# EAGLE design YPORT+_Unterteil (EAGLE 7.5.0)
Assembly variants: <unbenannt>
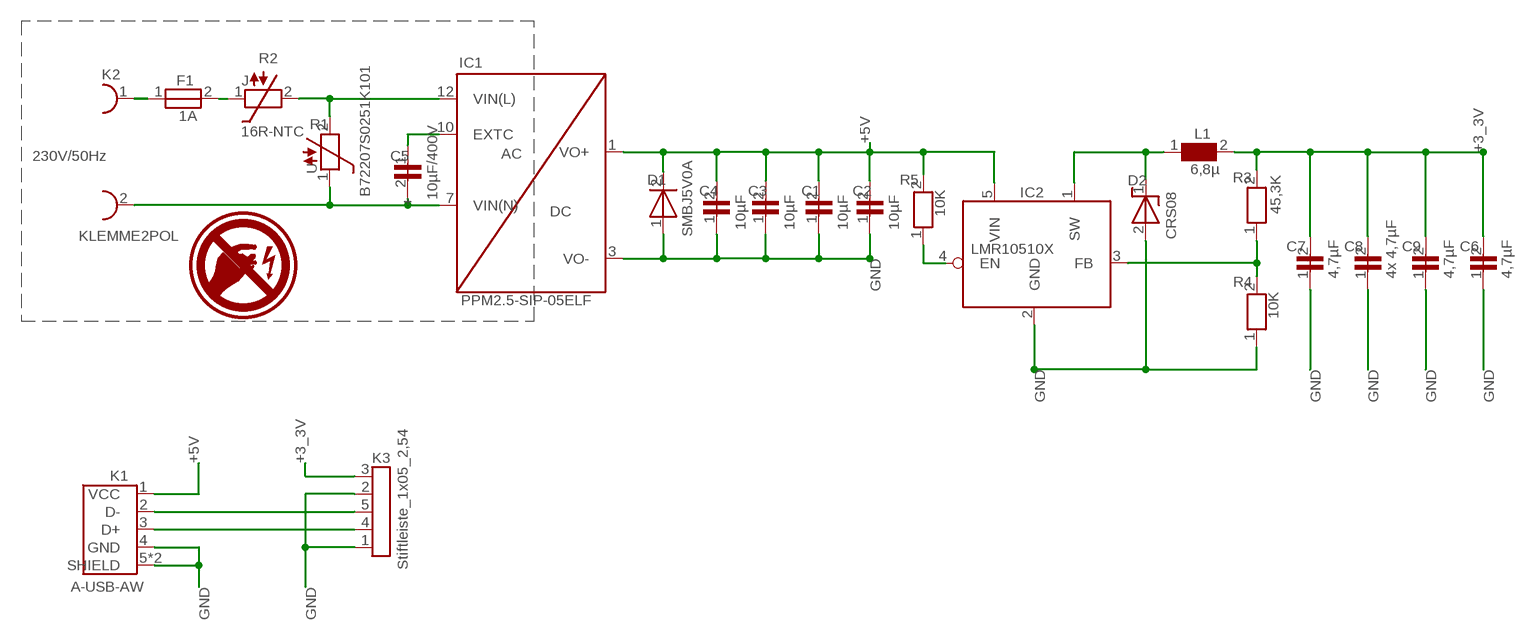
[diagram p0: schematic, sheet 1]

## Parts
C1  10µF  [0805]
C2  10µF  [0805]
C3  10µF  [0805]
C4  10µF  [0805]
C5  10µF/400V  [D10R5,08_ELKO]
C6  4,7µF  [0603_KLEIN]
C7  4,7µF  [0603_KLEIN]
C8  4x 4,7µF  4X_4,7µF  [0603_KLEIN]
C9  4,7µF  [0603_KLEIN]
D1  SMBJ5V0A  [DO214]
D2  CRS08  [SOD123]
F1  1A  [SMD-SICHERUNG]
IC1  PPM2.5-SIP-05ELF  [PPM1.65-S12-3R3ELF]
IC2  LMR10510X  [SOT23/5]
K1  A-USB-AW  [ASSMANN_A-USBS-A]
K2  KLEMME2POL  [AKL175_2]
K3  Stiftleiste_1x05_2,54  STIFTLEISTE_1X05_2,54  [STIFTLEISTE_1X05_G_2,54]
L1  6,8µ  [WÜRTH-744025002]
R1  B72207S0251K101  [6X10R5,08]
R2  16R-NTC  [6X10R5,08]
R3  45,3K  [0603_KLEIN]
R4  10K  [0603_KLEIN]
R5  10K  [0603_KLEIN]

## Nets
+3_3V: C6.2 C7.2 C8.2 C9.2 K3.3 L1.2 R3.2
+5V: C1.2 C2.2 C3.2 C4.2 D1.2 IC1.1(VO+) IC2.5(VIN) K1.1(VCC) R5.2
D+: K1.3(D+) K3.4
D-: K1.2(D-) K3.5
GND: C1.1 C2.1 C3.1 C4.1 C6.1 C7.1 C8.1 C9.1 D1.1 D2.2 IC1.3(VO-) IC2.2(GND) K1.4(GND) K1.5(SHIELD) K1.5_VIA_0(SHIELD) K3.1 K3.2 R4.1
SIG$3: F1.2 R2.1
SIG$4: IC1.12(VIN(L)) R1.2 R2.2
SIG$5: C5.2 IC1.7(VIN(N)) K2.2 R1.1
SIG$6: F1.1 K2.1
SIG$7: IC2.3(FB) R3.1 R4.2
SIG$8: C5.1(+) IC1.10(EXTC)
SIG$9: IC2.4(EN) R5.1
SW: D2.1 IC2.1(SW) L1.1

## Notes on the sheet
- 230V/50Hz

## Library data of the parts
C1-C4 = TARGET3001!_V31.8.0.48:10µF: SMD VS KONDENSATOR 0.1 UF 0805 50 V SMD-Vielschicht-Keramik-Kondensatoren Nennspannung 50 V - 1 pF - 1000 pF NPO; 1200 pF -1 µF X7R. Toleranz 1 pF ... 1000 pF: 5%; 1200 pF ... 1 µF: ±10%. Baugröße 0805 ; Wert 0,1 µ
C5 = TARGET3001!_V31.8.0.48:10µF/400V: Elektrolyt-Kondensatoren radial 105 øC, B41851-A3107-M..., Elko 400 V single endet , B43851A9106M[10UF/RM5]
C6 C7 C9 = TARGET3001!_V31.8.0.48:4,7µF: Keramik-Vielschicht-Kondensator 0,1µF, 50V
C8 = TARGET3001!_V31.8.0.48:4X_4,7µF: Keramik-Vielschicht-Kondensator 0,1µF, 50V
D1 = TARGET3001!_V31.8.0.48:SMBJ5V0A: Schutzdioden TRANSIL{~trademark}, SMD, Serie SM 6T6, Schutzdiode 600 W, SM6T 15A [DO214AA UNIDIR.]
D2 = TARGET3001!_V31.8.0.48:CRS08: Diode 40V, 1A
F1 = TARGET3001!_V31.8.0.48:1A: Rückstellbare Sicherungselement 0,3A, 60V
IC1 = TARGET3001!_V31.8.0.48:PPM2.5-SIP-05ELF
IC2 = TARGET3001!_V31.8.0.48:LMR10510X
K1 = TARGET3001!_V31.8.0.48:A-USB-AW: USB-Buchse Bauform-A abgewinkelt THT 04polig
K2 = TARGET3001!_V31.8.0.48:KLEMME2POL: Schraubklemme 2-polig RM5,08
K3 = TARGET3001!_V31.8.0.48:STIFTLEISTE_1X05_2,54: Stiftleiste
L1 = TARGET3001!_V31.8.0.48:6,8µ
R1 = TARGET3001!_V31.8.0.48:B72207S0251K101: Varistor
R2 = TARGET3001!_V31.8.0.48:16R-NTC: NTC-Widerstände scheibenförmig, Serie 235, Heissleiter [6 OHM], B57235-S609-M
R3 = TARGET3001!_V31.8.0.48:45,3K: SMD-Widerstand 1,5K-Ohm, 0,125W, 1%
R4 R5 = TARGET3001!_V31.8.0.48:10K: SMD-Widerstand 12K-Ohm, 0,125W, 1%

## Board
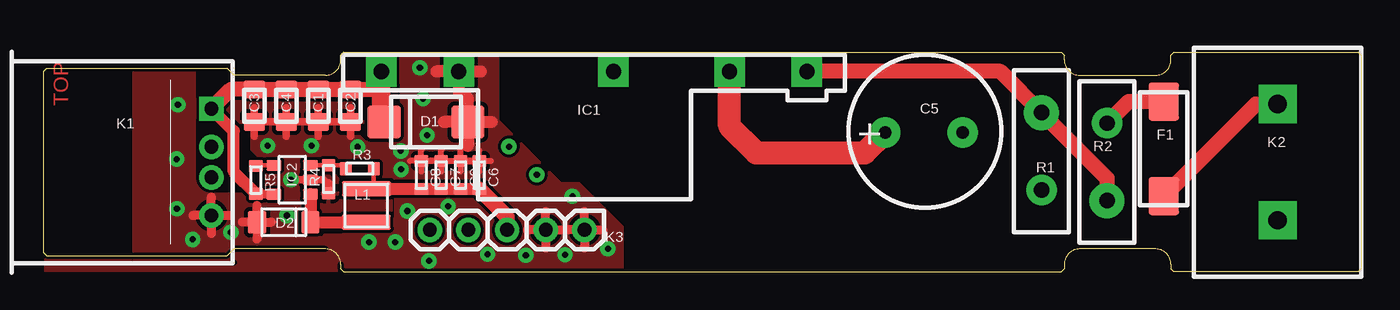
[diagram p1: board, top side]
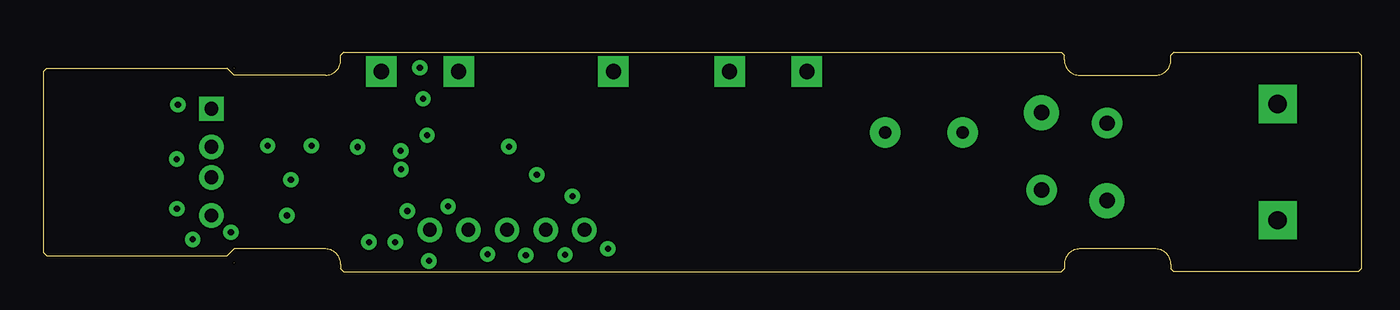
[diagram p2: board, inner layer 2]
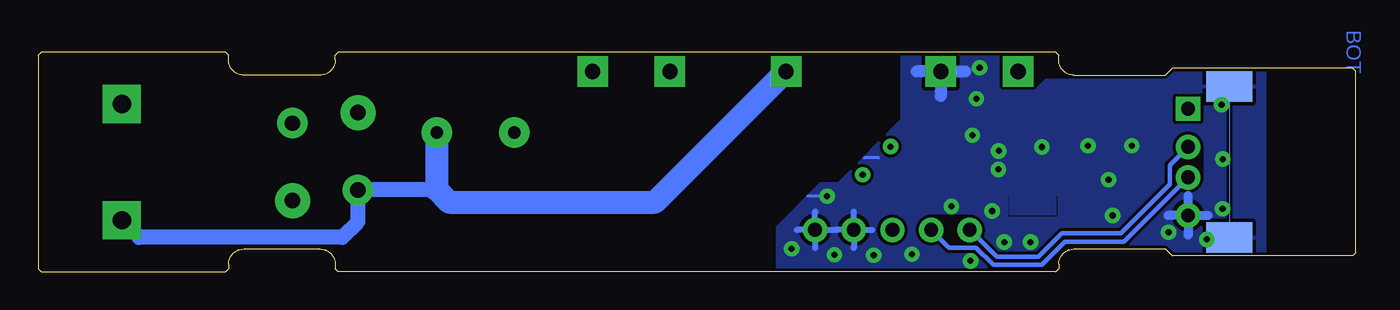
[diagram p3: board, bottom side, seen from below]

Size 86.5 x 14.4 mm. Coordinates in mm from the lower left corner, seen from the top.
Outline: 12.5,1.5 18.5,1.5 arc-90 19.5,0.5 19.5,0.2 19.7,0 66.8,0 67,0.2 67,0.5 arc-90 68,1.5 73,1.5 arc-90 74,0.5 74,0.2 74.2,0 86.3,0 86.5,0.2 86.5,14.2 86.3,14.4 74.2,14.4 74,14.2 74,13.9 arc-90 73,12.9 68,12.9 arc-90 67,13.9 67,14.2 66.8,14.4 19.7,14.4 19.5,14.2 19.5,13.9 arc-90 18.5,12.9 12.5,12.9
Outline: 12.5,12.9 12.5,12.9
Outline: 12.5,12.9 12.05,13.35 0.2,13.35 0,13.15 0,1.25 0.2,1.05 12.05,1.05 12.5,1.5
Outline: 12.5,1.5 12.5,1.5
Outline: 12.5,13.35 12.5,13.35
Outline: 12.5,0.6 12.5,0.6
Copper layers (1*16): Top 0.035mm / dielectric 1.5mm / Bottom 0.035mm
Design rules "TARGET3001!": minimum track width 0.2mm, minimum drill 0.4mm, track to track 0.2mm, track to pad 0.2mm, pad to pad 0.2mm, via to via 0.2mm, smd to smd 0.2mm, copper to edge 0mm, drill to drill 0.3mm, minimum pad ring 0.35mm, minimum via ring 0.3mm, stop-mask expansion 4mil, vias tented up to drill 0mil, thermal gap 10mil

### Footprints (pad centres in the part's own frame; a part is rotated, then mirrored left to right if it is on the bottom)
0805 = smd 1.165 x 1.38: 1 -1.067,0; 2 1.067,0
D10R5,08_ELKO = drill 0.8 pad 2 round: 1 -2.54,0; 2 2.54,0
0603_KLEIN = smd 0.8 x 0.9: 1 -0.917,0; 2 0.917,0
DO214 = smd 2.2 x 2.2: 1 -2.75,0; 2 2.75,0
SOD123 = smd 1.2 x 1.5: 1 1.75,0; 2 -1.75,0
SMD-SICHERUNG = smd 2.5 x 2: 1 0,0; 2 6.2,0
PPM1.65-S12-3R3ELF = drill 1 pad 2 square: 1 0,0; 3 5.08,0; 7 15.24,0; 10 22.86,0; 12 27.94,0
SOT23/5 = smd 0.7 x 1: 1 -0.95,-1.2; 2 -0.001,-1.2; 3 0.95,-1.2; 4 0.95,1.2; 5 -0.95,1.2
ASSMANN_A-USBS-A = drill 0.9 pad 1.6 square: 1 -3.5,5.86 | drill 0.9 pad 1.6 round: 2 -1,5.86; 3 1,5.86; 4 3.5,5.86 | smd 2 x 3 bottom: 5 -4.955,3.15; 5_VIA_0 4.953,3.15
AKL175_2 = drill 1.2 pad 2.5 square: 1 3.81,0; 2 -3.81,0
STIFTLEISTE_1X05_G_2,54 = drill 0.9 pad 1.6 round: 1 0,0; 2 2.54,0; 3 5.08,0; 4 7.62,0; 5 10.16,0
WÜRTH-744025002 = smd 1 x 3.2: 1 -1.1,0; 2 1.1,0
6X10R5,08 = drill 1 pad 2 round: 1 -2.54,0 | drill 1 pad 2.3 round: 2 2.54,0

### Placement (x,y rotation side)
C1  18.02,10.9 90 top
C2  20.15,10.9 90 top
C3  13.82,10.9 90 top
C4  15.93,10.9 90 top
C5  57.78,9.14 0 top
C6  28.59,6.36 270 top
C7  26.09,6.36 270 top
C8  24.79,6.35 270 top
C9  27.37,6.35 270 top
D1  25.1,9.83 180 top
D2  15.76,3.25 0 top
F1  73.52,4.97 90 top
IC1  22.16,13.15 0 top
IC2  16.32,6.04 90 top
K1  5.15,7.2 270 top
K2  81,7.2 90 top
K3  35.5,2.75 180 top
L1  21.18,4.35 90 top
R1  65.5,7.91 90 top
R2  69.8,7.21 270 top
R3  20.75,6.77 0 top
R4  18.71,6.07 90 top
R5  13.93,6.03 270 top

### Tracks (layer width: path | path; a pad name or v marks a point on that pad's centre or on a via)
2
  cutout Top: -26.9,-14.5 -26.91,-14.49 -26.92,-14.5 -26.92,-14.51 -26.92,-14.51 -26.91,-14.52 -26.9,-14.53 -26.89,-14.52 -26.89,-14.51 -26.89,-14.5
  cutout Top: 29.97,14.37 29.96,14.38 29.95,14.38 29.95,14.38 29.94,14.37 29.94,9.94 29.95,9.93 29.95,9.93 29.96,9.93 29.97,9.94
  cutout Top: 33.97,5.91 33.98,5.91 33.99,5.91 33.99,5.92 33.99,5.93 29.96,9.95 29.95,9.96 29.95,9.95 29.94,9.94 29.95,9.93
  cutout Top: 33.98,5.93 33.97,5.93 33.97,5.92 33.97,5.91 33.98,5.91 35.2,5.91 35.2,5.91 35.21,5.92 35.2,5.93 35.2,5.93
  cutout Top: 38.11,2.99 38.11,2.99 38.12,2.99 38.13,3 38.12,3.01 35.2,5.93 35.2,5.93 35.19,5.93 35.18,5.92 35.19,5.91
  cutout Top: 38.1,-0.01 38.11,-0.01 38.11,-0.02 38.12,-0.01 38.13,-0.01 38.13,3 38.12,3.01 38.11,3.01 38.11,3.01 38.1,3
  cutout Top: 38.1,0 38.1,-0.01 38.1,-0.02 38.11,-0.02 38.12,-0.02 38.12,-0.01 38.13,-0.01 38.12,0 38.11,0.01 38.11,0
  cutout Bottom: 29.97,14.4 29.96,14.41 29.95,14.41 29.95,14.41 29.94,14.4 29.94,9.97 29.95,9.96 29.95,9.96 29.96,9.96 29.97,9.97
  cutout Bottom: 34,5.91 34.01,5.91 34.02,5.91 34.02,5.92 34.02,5.93 29.96,9.98 29.95,9.98 29.95,9.98 29.94,9.97 29.95,9.96
  cutout Bottom: 35.18,5.91 35.19,5.91 35.19,5.92 35.19,5.93 35.18,5.93 34.01,5.93 34,5.93 33.99,5.92 34,5.91 34.01,5.91
  cutout Bottom: 38.11,2.97 38.12,2.97 38.12,2.97 38.13,2.98 38.12,2.99 35.19,5.93 35.18,5.93 35.17,5.93 35.17,5.92 35.17,5.91
  cutout Bottom: 38.1,0.01 38.11,0 38.12,-0.01 38.12,0 38.13,0.01 38.13,2.98 38.12,2.99 38.12,2.99 38.11,2.99 38.1,2.98
  cutout Bottom: 38.11,0.01 38.1,0 38.11,0 38.11,-0.01 38.12,0 38.12,0 38.13,0.01 38.12,0.01 38.12,0.02 38.11,0.01
  cutout Bottom: 27.94,3.71 27.95,3.72 27.96,3.73 27.95,3.73 27.94,3.74 25.4,3.74 25.39,3.73 25.38,3.73 25.39,3.72 25.4,3.71
  cutout Bottom: 10.01,6.18 10.01,6.18 10.02,6.17 10.03,6.18 10.03,6.18 10.03,8.2 10.03,8.21 10.02,8.21 10.01,8.21 10.01,8.2
  cutout Bottom: 20.38,12.7 20.38,12.71 20.39,12.71 20.38,12.72 20.38,12.73 18.33,12.73 18.32,12.72 18.32,12.71 18.32,12.71 18.33,12.7
  cutout Bottom: 21.07,12.01 21.08,12 21.08,12.01 21.09,12.01 21.08,12.02 20.38,12.72 20.38,12.73 20.37,12.72 20.36,12.71 20.37,12.71
  cutout Top: 14.48,5.65 14.49,5.64 14.5,5.63 14.51,5.64 14.51,5.65 14.51,6.45 14.51,6.45 14.5,6.46 14.49,6.45 14.48,6.45
  cutout Top: 13.57,11.11 13.57,11.12 13.56,11.12 13.55,11.12 13.55,11.11 13.55,10.58 13.55,10.57 13.56,10.57 13.57,10.57 13.57,10.58
  cutout Top: 13.66,11.19 13.66,11.2 13.66,11.2 13.65,11.21 13.64,11.2 13.55,11.12 13.55,11.11 13.55,11.1 13.56,11.1 13.57,11.1
  cutout Top: 20.26,11.18 20.26,11.19 20.27,11.2 20.26,11.2 20.26,11.21 13.65,11.21 13.64,11.2 13.64,11.2 13.64,11.19 13.65,11.18
  cutout Top: 20.4,11.03 20.41,11.03 20.42,11.03 20.42,11.04 20.42,11.05 20.26,11.2 20.26,11.21 20.25,11.2 20.24,11.2 20.25,11.19
  cutout Top: 20.4,10.53 20.4,10.52 20.41,10.51 20.42,10.52 20.42,10.53 20.42,11.04 20.42,11.05 20.41,11.06 20.4,11.05 20.4,11.04
  cutout Top: 20.41,10.51 20.42,10.51 20.42,10.51 20.43,10.52 20.42,10.53 20.42,10.54 20.41,10.54 20.4,10.54 20.4,10.53 20.4,10.52
  cutout Top: 13.54,7.95 13.55,7.94 13.56,7.94 13.56,7.94 13.57,7.95 13.57,9.09 13.56,9.09 13.56,9.1 13.55,9.09 13.54,9.09
  cutout Top: 14,7.49 14.01,7.48 14.02,7.49 14.02,7.5 14.02,7.5 13.56,7.96 13.56,7.96 13.55,7.96 13.54,7.95 13.55,7.94
  cutout Top: 10.04,13.67 10.04,13.68 10.03,13.69 10.02,13.68 10.02,13.67 10.02,11.43 10.02,11.43 10.03,11.42 10.04,11.43 10.04,11.43
  cutout Top: 10.02,6.12 10.02,6.11 10.03,6.11 10.04,6.11 10.04,6.12 10.04,10.03 10.04,10.04 10.03,10.04 10.02,10.04 10.02,10.03
  cutout Top: 10.04,6.1 10.04,6.1 10.05,6.1 10.06,6.11 10.05,6.12 10.04,6.13 10.03,6.13 10.02,6.13 10.02,6.12 10.02,6.11
  cutout Top: 11.04,5.25 11.03,5.25 11.02,5.24 11.03,5.23 11.04,5.23 12.99,5.23 13,5.23 13,5.24 13,5.25 12.99,5.25
  cutout Top: 13.16,5.05 13.17,5.05 13.18,5.05 13.18,5.06 13.18,5.07 13,5.25 12.99,5.25 12.98,5.25 12.98,5.24 12.98,5.23
  cutout Top: 18.53,6.45 18.54,6.46 18.54,6.47 18.54,6.48 18.53,6.48 18.5,6.48 18.49,6.48 18.48,6.47 18.49,6.46 18.5,6.45
  cutout Top: 18.8,7.5 18.79,7.5 18.78,7.49 18.79,7.48 18.8,7.48 18.91,7.48 18.91,7.48 18.92,7.49 18.91,7.5 18.91,7.5
  cutout Top: 24.52,6.01 24.53,6.01 24.53,6.02 24.53,6.03 24.52,6.03 22.98,6.03 22.97,6.03 22.96,6.02 22.97,6.01 22.98,6.01
  cutout Top: 22.87,6.15 22.86,6.15 22.85,6.15 22.84,6.14 22.85,6.13 22.97,6.01 22.97,6.01 22.98,6.01 22.99,6.02 22.98,6.03
  cutout Top: 25.55,7.85 25.56,7.86 25.56,7.87 25.56,7.88 25.55,7.88 25.25,7.88 25.25,7.88 25.24,7.87 25.25,7.86 25.25,7.85
  cutout Top: 25.55,7.85 25.55,7.85 25.56,7.85 25.57,7.86 25.56,7.87 25.56,7.88 25.55,7.88 25.54,7.88 25.54,7.87 25.54,7.86
  cutout Top: 26.87,7.85 26.88,7.86 26.89,7.86 26.88,7.87 26.87,7.88 26.57,7.88 26.56,7.87 26.55,7.86 26.56,7.86 26.57,7.85
  cutout Top: 28.08,7.85 28.09,7.85 28.1,7.86 28.09,7.87 28.08,7.87 27.86,7.87 27.85,7.87 27.85,7.86 27.85,7.85 27.86,7.85
  cutout Top: 28.08,7.85 28.09,7.84 28.1,7.85 28.1,7.86 28.1,7.86 28.09,7.87 28.08,7.87 28.07,7.87 28.07,7.86 28.07,7.85
  cutout Top: 25.58,6.67 25.59,6.67 25.59,6.68 25.59,6.69 25.58,6.7 25.28,6.7 25.27,6.69 25.27,6.68 25.27,6.67 25.28,6.67
  cutout Top: 25.58,6.67 25.59,6.67 25.59,6.67 25.6,6.68 25.59,6.69 25.59,6.69 25.58,6.7 25.57,6.69 25.57,6.68 25.57,6.67
  cutout Top: 26.87,6.67 26.88,6.67 26.88,6.68 26.88,6.69 26.87,6.7 26.6,6.7 26.59,6.69 26.59,6.68 26.59,6.67 26.6,6.67
  cutout Top: 28.08,6.67 28.09,6.67 28.09,6.68 28.09,6.69 28.08,6.69 27.85,6.69 27.84,6.69 27.84,6.68 27.84,6.67 27.85,6.67
  cutout Top: 28.1,6.68 28.1,6.69 28.1,6.7 28.09,6.7 28.08,6.7 28.07,6.69 28.07,6.68 28.07,6.67 28.08,6.67 28.09,6.67
  cutout Top: 20.71,9.05 20.72,9.05 20.72,9.06 20.72,9.07 20.71,9.07 20.7,9.07 20.69,9.07 20.69,9.06 20.69,9.05 20.7,9.05
  cutout Top: 21.13,8.62 21.14,8.62 21.15,8.62 21.15,8.63 21.15,8.64 20.72,9.07 20.71,9.07 20.7,9.07 20.7,9.06 20.7,9.05
  cutout Top: 23.32,11.02 23.33,11.01 23.34,11.01 23.35,11.01 23.35,11.02 23.35,12.32 23.35,12.33 23.34,12.33 23.33,12.33 23.32,12.32
  cutout Top: 21.23,7.4 21.23,7.4 21.24,7.41 21.23,7.42 21.23,7.42 20.25,7.42 20.24,7.42 20.24,7.41 20.24,7.4 20.25,7.4
  cutout Top: 21.22,7.4 21.23,7.4 21.24,7.4 21.24,7.41 21.24,7.42 21.23,7.42 21.23,7.42 21.22,7.42 21.21,7.41 21.22,7.4
  cutout Top: 22.96,4.85 22.96,4.86 22.95,4.86 22.94,4.86 22.94,4.85 22.94,3.79 22.94,3.78 22.95,3.77 22.96,3.78 22.96,3.79
  cutout Top: 18.98,6.23 18.98,6.24 18.97,6.24 18.96,6.24 18.96,6.23 18.96,5.74 18.96,5.73 18.97,5.72 18.98,5.73 18.98,5.74
  cutout Top: 18.79,6.42 18.79,6.42 18.78,6.42 18.77,6.41 18.78,6.4 18.96,6.22 18.97,6.22 18.98,6.22 18.98,6.23 18.98,6.24
  cutout Top: 18.45,2.57 18.44,2.57 18.44,2.56 18.44,2.55 18.45,2.54 19.59,2.54 19.59,2.55 19.6,2.56 19.59,2.57 19.59,2.57
  cutout Top: 18.23,2.36 18.23,2.35 18.23,2.34 18.24,2.34 18.25,2.34 18.46,2.55 18.46,2.56 18.46,2.57 18.45,2.57 18.44,2.57
  cutout Top: 5.8,0.73 5.81,0.72 5.82,0.72 5.82,0.72 5.83,0.73 5.83,13.8 5.82,13.81 5.82,13.81 5.81,13.81 5.8,13.8
  cutout Bottom: 5.82,0.68 5.82,0.67 5.83,0.67 5.84,0.67 5.84,0.68 5.84,13.7 5.84,13.7 5.83,13.71 5.82,13.7 5.82,13.7
  cutout Bottom: 19.61,4.96 19.61,4.97 19.6,4.97 19.59,4.97 19.59,4.96 19.59,3.65 19.59,3.64 19.6,3.64 19.61,3.64 19.61,3.65
  cutout Bottom: 22.77,4.95 22.78,4.95 22.78,4.96 22.78,4.97 22.77,4.97 19.6,4.97 19.59,4.97 19.59,4.96 19.59,4.95 19.6,4.95
  cutout Bottom: 22.76,3.65 22.76,3.64 22.77,3.64 22.78,3.64 22.78,3.65 22.78,4.96 22.78,4.97 22.77,4.97 22.76,4.97 22.76,4.96
  cutout Bottom: 19.6,3.66 19.59,3.66 19.59,3.65 19.59,3.64 19.6,3.64 22.77,3.64 22.78,3.64 22.78,3.65 22.78,3.66 22.77,3.66
  cutout Bottom: 0.2,13.15 0.14,13.29 0,13.35 -0.14,13.29 -0.2,13.15 -0.2,1.25 -0.14,1.11 0,1.05 0.14,1.11 0.2,1.25
  cutout layer 2: 0.2,13.15 0.14,13.29 0,13.35 -0.14,13.29 -0.2,13.15 -0.2,1.25 -0.14,1.11 0,1.05 0.14,1.11 0.2,1.25
  cutout layer 2: 0.2,13.15 0.14,13.29 0,13.35 -0.14,13.29 -0.2,13.15 -0.2,1.25 -0.14,1.11 0,1.05 0.14,1.11 0.2,1.25
  cutout Top: 0.2,13.15 0.14,13.29 0,13.35 -0.14,13.29 -0.2,13.15 -0.2,1.25 -0.14,1.11 0,1.05 0.14,1.11 0.2,1.25
  cutout Bottom: 86.3,0.2 86.36,0.06 86.5,0 86.64,0.06 86.7,0.2 86.7,14.2 86.64,14.34 86.5,14.4 86.36,14.34 86.3,14.2
  cutout layer 2: 86.3,0.2 86.36,0.06 86.5,0 86.64,0.06 86.7,0.2 86.7,14.2 86.64,14.34 86.5,14.4 86.36,14.34 86.3,14.2
  cutout layer 2: 86.3,0.2 86.36,0.06 86.5,0 86.64,0.06 86.7,0.2 86.7,14.2 86.64,14.34 86.5,14.4 86.36,14.34 86.3,14.2
  cutout Top: 86.3,0.2 86.36,0.06 86.5,0 86.64,0.06 86.7,0.2 86.7,14.2 86.64,14.34 86.5,14.4 86.36,14.34 86.3,14.2
  cutout Bottom: 12.05,13.15 12.19,13.21 12.25,13.35 12.19,13.49 12.05,13.55 0.2,13.55 0.06,13.49 0,13.35 0.06,13.21 0.2,13.15
  cutout layer 2: 12.05,13.15 12.19,13.21 12.25,13.35 12.19,13.49 12.05,13.55 0.2,13.55 0.06,13.49 0,13.35 0.06,13.21 0.2,13.15
  cutout layer 2: 12.05,13.15 12.19,13.21 12.25,13.35 12.19,13.49 12.05,13.55 0.2,13.55 0.06,13.49 0,13.35 0.06,13.21 0.2,13.15
  cutout Top: 12.05,13.15 12.19,13.21 12.25,13.35 12.19,13.49 12.05,13.55 0.2,13.55 0.06,13.49 0,13.35 0.06,13.21 0.2,13.15
  cutout Bottom: 12.5,1.7 12.36,1.64 12.3,1.5 12.36,1.36 12.5,1.3 18.5,1.3 18.64,1.36 18.7,1.5 18.64,1.64 18.5,1.7
  cutout layer 2: 12.5,1.7 12.36,1.64 12.3,1.5 12.36,1.36 12.5,1.3 18.5,1.3 18.64,1.36 18.7,1.5 18.64,1.64 18.5,1.7
  cutout layer 2: 12.5,1.7 12.36,1.64 12.3,1.5 12.36,1.36 12.5,1.3 18.5,1.3 18.64,1.36 18.7,1.5 18.64,1.64 18.5,1.7
  cutout Top: 12.5,1.7 12.36,1.64 12.3,1.5 12.36,1.36 12.5,1.3 18.5,1.3 18.64,1.36 18.7,1.5 18.64,1.64 18.5,1.7
  cutout Bottom: 19.3,0.2 19.36,0.06 19.5,0 19.64,0.06 19.7,0.2 19.7,0.5 19.64,0.64 19.5,0.7 19.36,0.64 19.3,0.5
  cutout layer 2: 19.3,0.2 19.36,0.06 19.5,0 19.64,0.06 19.7,0.2 19.7,0.5 19.64,0.64 19.5,0.7 19.36,0.64 19.3,0.5
  cutout layer 2: 19.3,0.2 19.36,0.06 19.5,0 19.64,0.06 19.7,0.2 19.7,0.5 19.64,0.64 19.5,0.7 19.36,0.64 19.3,0.5
  cutout Top: 19.3,0.2 19.36,0.06 19.5,0 19.64,0.06 19.7,0.2 19.7,0.5 19.64,0.64 19.5,0.7 19.36,0.64 19.3,0.5
  cutout Bottom: 12.05,0.85 12.19,0.91 12.25,1.05 12.19,1.19 12.05,1.25 0.2,1.25 0.06,1.19 0,1.05 0.06,0.91 0.2,0.85
  cutout layer 2: 12.05,0.85 12.19,0.91 12.25,1.05 12.19,1.19 12.05,1.25 0.2,1.25 0.06,1.19 0,1.05 0.06,0.91 0.2,0.85
  cutout layer 2: 12.05,0.85 12.19,0.91 12.25,1.05 12.19,1.19 12.05,1.25 0.2,1.25 0.06,1.19 0,1.05 0.06,0.91 0.2,0.85
  cutout Top: 12.05,0.85 12.19,0.91 12.25,1.05 12.19,1.19 12.05,1.25 0.2,1.25 0.06,1.19 0,1.05 0.06,0.91 0.2,0.85
  cutout Bottom: 74.2,0.2 74.06,0.14 74,0 74.06,-0.14 74.2,-0.2 86.3,-0.2 86.44,-0.14 86.5,0 86.44,0.14 86.3,0.2
  cutout layer 2: 74.2,0.2 74.06,0.14 74,0 74.06,-0.14 74.2,-0.2 86.3,-0.2 86.44,-0.14 86.5,0 86.44,0.14 86.3,0.2
  cutout layer 2: 74.2,0.2 74.06,0.14 74,0 74.06,-0.14 74.2,-0.2 86.3,-0.2 86.44,-0.14 86.5,0 86.44,0.14 86.3,0.2
  cutout Top: 74.2,0.2 74.06,0.14 74,0 74.06,-0.14 74.2,-0.2 86.3,-0.2 86.44,-0.14 86.5,0 86.44,0.14 86.3,0.2
  cutout Bottom: 12.7,13.35 12.67,13.46 12.58,13.53 12.47,13.55 12.37,13.5 12.31,13.41 12.31,13.29 12.37,13.2 12.47,13.15 12.58,13.17 12.67,13.24
  cutout layer 2: 12.7,13.35 12.67,13.46 12.58,13.53 12.47,13.55 12.37,13.5 12.31,13.41 12.31,13.29 12.37,13.2 12.47,13.15 12.58,13.17 12.67,13.24
  cutout layer 2: 12.7,13.35 12.67,13.46 12.58,13.53 12.47,13.55 12.37,13.5 12.31,13.41 12.31,13.29 12.37,13.2 12.47,13.15 12.58,13.17 12.67,13.24
  cutout Top: 12.7,13.35 12.67,13.46 12.58,13.53 12.47,13.55 12.37,13.5 12.31,13.41 12.31,13.29 12.37,13.2 12.47,13.15 12.58,13.17 12.67,13.24
  cutout Bottom: 12.5,13.1 12.36,13.04 12.3,12.9 12.36,12.76 12.5,12.7 18.5,12.7 18.64,12.76 18.7,12.9 18.64,13.04 18.5,13.1
  cutout layer 2: 12.5,13.1 12.36,13.04 12.3,12.9 12.36,12.76 12.5,12.7 18.5,12.7 18.64,12.76 18.7,12.9 18.64,13.04 18.5,13.1
  cutout layer 2: 12.5,13.1 12.36,13.04 12.3,12.9 12.36,12.76 12.5,12.7 18.5,12.7 18.64,12.76 18.7,12.9 18.64,13.04 18.5,13.1
  cutout Top: 12.5,13.1 12.36,13.04 12.3,12.9 12.36,12.76 12.5,12.7 18.5,12.7 18.64,12.76 18.7,12.9 18.64,13.04 18.5,13.1
  cutout Bottom: 19.7,14.2 19.64,14.34 19.5,14.4 19.36,14.34 19.3,14.2 19.3,13.9 19.36,13.76 19.5,13.7 19.64,13.76 19.7,13.9
  cutout layer 2: 19.7,14.2 19.64,14.34 19.5,14.4 19.36,14.34 19.3,14.2 19.3,13.9 19.36,13.76 19.5,13.7 19.64,13.76 19.7,13.9
  cutout layer 2: 19.7,14.2 19.64,14.34 19.5,14.4 19.36,14.34 19.3,14.2 19.3,13.9 19.36,13.76 19.5,13.7 19.64,13.76 19.7,13.9
  cutout Top: 19.7,14.2 19.64,14.34 19.5,14.4 19.36,14.34 19.3,14.2 19.3,13.9 19.36,13.76 19.5,13.7 19.64,13.76 19.7,13.9
  cutout Bottom: 66.8,14.2 66.94,14.26 67,14.4 66.94,14.54 66.8,14.6 19.7,14.6 19.56,14.54 19.5,14.4 19.56,14.26 19.7,14.2
  cutout layer 2: 66.8,14.2 66.94,14.26 67,14.4 66.94,14.54 66.8,14.6 19.7,14.6 19.56,14.54 19.5,14.4 19.56,14.26 19.7,14.2
  cutout layer 2: 66.8,14.2 66.94,14.26 67,14.4 66.94,14.54 66.8,14.6 19.7,14.6 19.56,14.54 19.5,14.4 19.56,14.26 19.7,14.2
  cutout Top: 66.8,14.2 66.94,14.26 67,14.4 66.94,14.54 66.8,14.6 19.7,14.6 19.56,14.54 19.5,14.4 19.56,14.26 19.7,14.2
  cutout Bottom: 73.8,0.2 73.86,0.06 74,0 74.14,0.06 74.2,0.2 74.2,0.5 74.14,0.64 74,0.7 73.86,0.64 73.8,0.5
  cutout layer 2: 73.8,0.2 73.86,0.06 74,0 74.14,0.06 74.2,0.2 74.2,0.5 74.14,0.64 74,0.7 73.86,0.64 73.8,0.5
  cutout layer 2: 73.8,0.2 73.86,0.06 74,0 74.14,0.06 74.2,0.2 74.2,0.5 74.14,0.64 74,0.7 73.86,0.64 73.8,0.5
  cutout Top: 73.8,0.2 73.86,0.06 74,0 74.14,0.06 74.2,0.2 74.2,0.5 74.14,0.64 74,0.7 73.86,0.64 73.8,0.5
  cutout Bottom: 68,1.7 67.86,1.64 67.8,1.5 67.86,1.36 68,1.3 73,1.3 73.14,1.36 73.2,1.5 73.14,1.64 73,1.7
  cutout layer 2: 68,1.7 67.86,1.64 67.8,1.5 67.86,1.36 68,1.3 73,1.3 73.14,1.36 73.2,1.5 73.14,1.64 73,1.7
  cutout layer 2: 68,1.7 67.86,1.64 67.8,1.5 67.86,1.36 68,1.3 73,1.3 73.14,1.36 73.2,1.5 73.14,1.64 73,1.7
  cutout Top: 68,1.7 67.86,1.64 67.8,1.5 67.86,1.36 68,1.3 73,1.3 73.14,1.36 73.2,1.5 73.14,1.64 73,1.7
  cutout Bottom: 66.8,0.2 66.86,0.06 67,0 67.14,0.06 67.2,0.2 67.2,0.5 67.14,0.64 67,0.7 66.86,0.64 66.8,0.5
  cutout layer 2: 66.8,0.2 66.86,0.06 67,0 67.14,0.06 67.2,0.2 67.2,0.5 67.14,0.64 67,0.7 66.86,0.64 66.8,0.5
  cutout layer 2: 66.8,0.2 66.86,0.06 67,0 67.14,0.06 67.2,0.2 67.2,0.5 67.14,0.64 67,0.7 66.86,0.64 66.8,0.5
  cutout Top: 66.8,0.2 66.86,0.06 67,0 67.14,0.06 67.2,0.2 67.2,0.5 67.14,0.64 67,0.7 66.86,0.64 66.8,0.5
  cutout Bottom: 66.8,-0.2 66.94,-0.14 67,0 66.94,0.14 66.8,0.2 19.7,0.2 19.56,0.14 19.5,0 19.56,-0.14 19.7,-0.2
  cutout layer 2: 66.8,-0.2 66.94,-0.14 67,0 66.94,0.14 66.8,0.2 19.7,0.2 19.56,0.14 19.5,0 19.56,-0.14 19.7,-0.2
  cutout layer 2: 66.8,-0.2 66.94,-0.14 67,0 66.94,0.14 66.8,0.2 19.7,0.2 19.56,0.14 19.5,0 19.56,-0.14 19.7,-0.2
  cutout Top: 66.8,-0.2 66.94,-0.14 67,0 66.94,0.14 66.8,0.2 19.7,0.2 19.56,0.14 19.5,0 19.56,-0.14 19.7,-0.2
  cutout Bottom: 74.2,14.2 74.14,14.34 74,14.4 73.86,14.34 73.8,14.2 73.8,13.9 73.86,13.76 74,13.7 74.14,13.76 74.2,13.9
  cutout layer 2: 74.2,14.2 74.14,14.34 74,14.4 73.86,14.34 73.8,14.2 73.8,13.9 73.86,13.76 74,13.7 74.14,13.76 74.2,13.9
  cutout layer 2: 74.2,14.2 74.14,14.34 74,14.4 73.86,14.34 73.8,14.2 73.8,13.9 73.86,13.76 74,13.7 74.14,13.76 74.2,13.9
  cutout Top: 74.2,14.2 74.14,14.34 74,14.4 73.86,14.34 73.8,14.2 73.8,13.9 73.86,13.76 74,13.7 74.14,13.76 74.2,13.9
  cutout Bottom: 73,12.7 73.14,12.76 73.2,12.9 73.14,13.04 73,13.1 68,13.1 67.86,13.04 67.8,12.9 67.86,12.76 68,12.7
  cutout layer 2: 73,12.7 73.14,12.76 73.2,12.9 73.14,13.04 73,13.1 68,13.1 67.86,13.04 67.8,12.9 67.86,12.76 68,12.7
  cutout layer 2: 73,12.7 73.14,12.76 73.2,12.9 73.14,13.04 73,13.1 68,13.1 67.86,13.04 67.8,12.9 67.86,12.76 68,12.7
  cutout Top: 73,12.7 73.14,12.76 73.2,12.9 73.14,13.04 73,13.1 68,13.1 67.86,13.04 67.8,12.9 67.86,12.76 68,12.7
  cutout Bottom: 67.2,14.2 67.14,14.34 67,14.4 66.86,14.34 66.8,14.2 66.8,13.9 66.86,13.76 67,13.7 67.14,13.76 67.2,13.9
  cutout layer 2: 67.2,14.2 67.14,14.34 67,14.4 66.86,14.34 66.8,14.2 66.8,13.9 66.86,13.76 67,13.7 67.14,13.76 67.2,13.9
  cutout layer 2: 67.2,14.2 67.14,14.34 67,14.4 66.86,14.34 66.8,14.2 66.8,13.9 66.86,13.76 67,13.7 67.14,13.76 67.2,13.9
  cutout Top: 67.2,14.2 67.14,14.34 67,14.4 66.86,14.34 66.8,14.2 66.8,13.9 66.86,13.76 67,13.7 67.14,13.76 67.2,13.9
  cutout Bottom: 86.3,14.2 86.44,14.26 86.5,14.4 86.44,14.54 86.3,14.6 74.2,14.6 74.06,14.54 74,14.4 74.06,14.26 74.2,14.2
  cutout layer 2: 86.3,14.2 86.44,14.26 86.5,14.4 86.44,14.54 86.3,14.6 74.2,14.6 74.06,14.54 74,14.4 74.06,14.26 74.2,14.2
  cutout layer 2: 86.3,14.2 86.44,14.26 86.5,14.4 86.44,14.54 86.3,14.6 74.2,14.6 74.06,14.54 74,14.4 74.06,14.26 74.2,14.2
  cutout Top: 86.3,14.2 86.44,14.26 86.5,14.4 86.44,14.54 86.3,14.6 74.2,14.6 74.06,14.54 74,14.4 74.06,14.26 74.2,14.2
  cutout Bottom: 19.64,0.34 19.5,0.4 19.36,0.34 19.3,0.2 19.36,0.06 19.56,-0.14 19.7,-0.2 19.84,-0.14 19.9,0 19.84,0.14
  cutout layer 2: 19.64,0.34 19.5,0.4 19.36,0.34 19.3,0.2 19.36,0.06 19.56,-0.14 19.7,-0.2 19.84,-0.14 19.9,0 19.84,0.14
  cutout layer 2: 19.64,0.34 19.5,0.4 19.36,0.34 19.3,0.2 19.36,0.06 19.56,-0.14 19.7,-0.2 19.84,-0.14 19.9,0 19.84,0.14
  cutout Top: 19.64,0.34 19.5,0.4 19.36,0.34 19.3,0.2 19.36,0.06 19.56,-0.14 19.7,-0.2 19.84,-0.14 19.9,0 19.84,0.14
  cutout Bottom: 19.36,14.34 19.3,14.2 19.36,14.06 19.5,14 19.64,14.06 19.84,14.26 19.9,14.4 19.84,14.54 19.7,14.6 19.56,14.54
  cutout layer 2: 19.36,14.34 19.3,14.2 19.36,14.06 19.5,14 19.64,14.06 19.84,14.26 19.9,14.4 19.84,14.54 19.7,14.6 19.56,14.54
  cutout layer 2: 19.36,14.34 19.3,14.2 19.36,14.06 19.5,14 19.64,14.06 19.84,14.26 19.9,14.4 19.84,14.54 19.7,14.6 19.56,14.54
  cutout Top: 19.36,14.34 19.3,14.2 19.36,14.06 19.5,14 19.64,14.06 19.84,14.26 19.9,14.4 19.84,14.54 19.7,14.6 19.56,14.54
  cutout Bottom: 66.86,14.06 67,14 67.14,14.06 67.2,14.2 67.14,14.34 66.94,14.54 66.8,14.6 66.66,14.54 66.6,14.4 66.66,14.26
  cutout layer 2: 66.86,14.06 67,14 67.14,14.06 67.2,14.2 67.14,14.34 66.94,14.54 66.8,14.6 66.66,14.54 66.6,14.4 66.66,14.26
  cutout layer 2: 66.86,14.06 67,14 67.14,14.06 67.2,14.2 67.14,14.34 66.94,14.54 66.8,14.6 66.66,14.54 66.6,14.4 66.66,14.26
  cutout Top: 66.86,14.06 67,14 67.14,14.06 67.2,14.2 67.14,14.34 66.94,14.54 66.8,14.6 66.66,14.54 66.6,14.4 66.66,14.26
  cutout Bottom: 73.86,14.34 73.8,14.2 73.86,14.06 74,14 74.14,14.06 74.34,14.26 74.4,14.4 74.34,14.54 74.2,14.6 74.06,14.54
  cutout layer 2: 73.86,14.34 73.8,14.2 73.86,14.06 74,14 74.14,14.06 74.34,14.26 74.4,14.4 74.34,14.54 74.2,14.6 74.06,14.54
  cutout layer 2: 73.86,14.34 73.8,14.2 73.86,14.06 74,14 74.14,14.06 74.34,14.26 74.4,14.4 74.34,14.54 74.2,14.6 74.06,14.54
  cutout Top: 73.86,14.34 73.8,14.2 73.86,14.06 74,14 74.14,14.06 74.34,14.26 74.4,14.4 74.34,14.54 74.2,14.6 74.06,14.54
  cutout Bottom: 86.44,14.54 86.3,14.6 86.16,14.54 86.1,14.4 86.16,14.26 86.36,14.06 86.5,14 86.64,14.06 86.7,14.2 86.64,14.34
  cutout layer 2: 86.44,14.54 86.3,14.6 86.16,14.54 86.1,14.4 86.16,14.26 86.36,14.06 86.5,14 86.64,14.06 86.7,14.2 86.64,14.34
  cutout layer 2: 86.44,14.54 86.3,14.6 86.16,14.54 86.1,14.4 86.16,14.26 86.36,14.06 86.5,14 86.64,14.06 86.7,14.2 86.64,14.34
  cutout Top: 86.44,14.54 86.3,14.6 86.16,14.54 86.1,14.4 86.16,14.26 86.36,14.06 86.5,14 86.64,14.06 86.7,14.2 86.64,14.34
  cutout Bottom: 86.16,0.14 86.1,0 86.16,-0.14 86.3,-0.2 86.44,-0.14 86.64,0.06 86.7,0.2 86.64,0.34 86.5,0.4 86.36,0.34
  cutout layer 2: 86.16,0.14 86.1,0 86.16,-0.14 86.3,-0.2 86.44,-0.14 86.64,0.06 86.7,0.2 86.64,0.34 86.5,0.4 86.36,0.34
  cutout layer 2: 86.16,0.14 86.1,0 86.16,-0.14 86.3,-0.2 86.44,-0.14 86.64,0.06 86.7,0.2 86.64,0.34 86.5,0.4 86.36,0.34
  cutout Top: 86.16,0.14 86.1,0 86.16,-0.14 86.3,-0.2 86.44,-0.14 86.64,0.06 86.7,0.2 86.64,0.34 86.5,0.4 86.36,0.34
  cutout Bottom: 74.14,0.34 74,0.4 73.86,0.34 73.8,0.2 73.86,0.06 74.06,-0.14 74.2,-0.2 74.34,-0.14 74.4,0 74.34,0.14
  cutout layer 2: 74.14,0.34 74,0.4 73.86,0.34 73.8,0.2 73.86,0.06 74.06,-0.14 74.2,-0.2 74.34,-0.14 74.4,0 74.34,0.14
  cutout layer 2: 74.14,0.34 74,0.4 73.86,0.34 73.8,0.2 73.86,0.06 74.06,-0.14 74.2,-0.2 74.34,-0.14 74.4,0 74.34,0.14
  cutout Top: 74.14,0.34 74,0.4 73.86,0.34 73.8,0.2 73.86,0.06 74.06,-0.14 74.2,-0.2 74.34,-0.14 74.4,0 74.34,0.14
  cutout Bottom: 67.14,0.06 67.2,0.2 67.14,0.34 67,0.4 66.86,0.34 66.66,0.14 66.6,0 66.66,-0.14 66.8,-0.2 66.94,-0.14
  cutout layer 2: 67.14,0.06 67.2,0.2 67.14,0.34 67,0.4 66.86,0.34 66.66,0.14 66.6,0 66.66,-0.14 66.8,-0.2 66.94,-0.14
  cutout layer 2: 67.14,0.06 67.2,0.2 67.14,0.34 67,0.4 66.86,0.34 66.66,0.14 66.6,0 66.66,-0.14 66.8,-0.2 66.94,-0.14
  cutout Top: 67.14,0.06 67.2,0.2 67.14,0.34 67,0.4 66.86,0.34 66.66,0.14 66.6,0 66.66,-0.14 66.8,-0.2 66.94,-0.14
  cutout Bottom: 12.7,0.6 12.67,0.71 12.58,0.78 12.47,0.8 12.37,0.75 12.31,0.66 12.31,0.54 12.37,0.45 12.47,0.4 12.58,0.42 12.67,0.49
  cutout layer 2: 12.7,0.6 12.67,0.71 12.58,0.78 12.47,0.8 12.37,0.75 12.31,0.66 12.31,0.54 12.37,0.45 12.47,0.4 12.58,0.42 12.67,0.49
  cutout layer 2: 12.7,0.6 12.67,0.71 12.58,0.78 12.47,0.8 12.37,0.75 12.31,0.66 12.31,0.54 12.37,0.45 12.47,0.4 12.58,0.42 12.67,0.49
  cutout Top: 12.7,0.6 12.67,0.71 12.58,0.78 12.47,0.8 12.37,0.75 12.31,0.66 12.31,0.54 12.37,0.45 12.47,0.4 12.58,0.42 12.67,0.49
  cutout Bottom: 0.34,13.21 0.4,13.35 0.34,13.49 0.2,13.55 0.06,13.49 -0.14,13.29 -0.2,13.15 -0.14,13.01 0,12.95 0.14,13.01
  cutout layer 2: 0.34,13.21 0.4,13.35 0.34,13.49 0.2,13.55 0.06,13.49 -0.14,13.29 -0.2,13.15 -0.14,13.01 0,12.95 0.14,13.01
  cutout layer 2: 0.34,13.21 0.4,13.35 0.34,13.49 0.2,13.55 0.06,13.49 -0.14,13.29 -0.2,13.15 -0.14,13.01 0,12.95 0.14,13.01
  cutout Top: 0.34,13.21 0.4,13.35 0.34,13.49 0.2,13.55 0.06,13.49 -0.14,13.29 -0.2,13.15 -0.14,13.01 0,12.95 0.14,13.01
  cutout Bottom: 0.06,0.91 0.2,0.85 0.34,0.91 0.4,1.05 0.34,1.19 0.14,1.39 0,1.45 -0.14,1.39 -0.2,1.25 -0.14,1.11
  cutout layer 2: 0.06,0.91 0.2,0.85 0.34,0.91 0.4,1.05 0.34,1.19 0.14,1.39 0,1.45 -0.14,1.39 -0.2,1.25 -0.14,1.11
  cutout layer 2: 0.06,0.91 0.2,0.85 0.34,0.91 0.4,1.05 0.34,1.19 0.14,1.39 0,1.45 -0.14,1.39 -0.2,1.25 -0.14,1.11
  cutout Top: 0.06,0.91 0.2,0.85 0.34,0.91 0.4,1.05 0.34,1.19 0.14,1.39 0,1.45 -0.14,1.39 -0.2,1.25 -0.14,1.11
  cutout Bottom: 12.3,12.9 12.36,12.76 12.5,12.7 12.64,12.76 12.7,12.9 12.7,12.9 12.64,13.04 12.5,13.1 12.36,13.04 12.3,12.9
  cutout layer 2: 12.3,12.9 12.36,12.76 12.5,12.7 12.64,12.76 12.7,12.9 12.7,12.9 12.64,13.04 12.5,13.1 12.36,13.04 12.3,12.9
  cutout layer 2: 12.3,12.9 12.36,12.76 12.5,12.7 12.64,12.76 12.7,12.9 12.7,12.9 12.64,13.04 12.5,13.1 12.36,13.04 12.3,12.9
  cutout Top: 12.3,12.9 12.36,12.76 12.5,12.7 12.64,12.76 12.7,12.9 12.7,12.9 12.64,13.04 12.5,13.1 12.36,13.04 12.3,12.9
  cutout Bottom: 12.19,13.49 12.05,13.55 11.91,13.49 11.85,13.35 11.91,13.21 12.36,12.76 12.5,12.7 12.64,12.76 12.7,12.9 12.64,13.04
  cutout layer 2: 12.19,13.49 12.05,13.55 11.91,13.49 11.85,13.35 11.91,13.21 12.36,12.76 12.5,12.7 12.64,12.76 12.7,12.9 12.64,13.04
  cutout layer 2: 12.19,13.49 12.05,13.55 11.91,13.49 11.85,13.35 11.91,13.21 12.36,12.76 12.5,12.7 12.64,12.76 12.7,12.9 12.64,13.04
  cutout Top: 12.19,13.49 12.05,13.55 11.91,13.49 11.85,13.35 11.91,13.21 12.36,12.76 12.5,12.7 12.64,12.76 12.7,12.9 12.64,13.04
  cutout Bottom: 12.7,1.5 12.67,1.61 12.58,1.68 12.47,1.7 12.37,1.65 12.31,1.56 12.31,1.44 12.37,1.35 12.47,1.3 12.58,1.32 12.67,1.39
  cutout layer 2: 12.7,1.5 12.67,1.61 12.58,1.68 12.47,1.7 12.37,1.65 12.31,1.56 12.31,1.44 12.37,1.35 12.47,1.3 12.58,1.32 12.67,1.39
  cutout layer 2: 12.7,1.5 12.67,1.61 12.58,1.68 12.47,1.7 12.37,1.65 12.31,1.56 12.31,1.44 12.37,1.35 12.47,1.3 12.58,1.32 12.67,1.39
  cutout Top: 12.7,1.5 12.67,1.61 12.58,1.68 12.47,1.7 12.37,1.65 12.31,1.56 12.31,1.44 12.37,1.35 12.47,1.3 12.58,1.32 12.67,1.39
  cutout Bottom: 11.91,1.19 11.85,1.05 11.91,0.91 12.05,0.85 12.19,0.91 12.64,1.36 12.7,1.5 12.64,1.64 12.5,1.7 12.36,1.64
  cutout layer 2: 11.91,1.19 11.85,1.05 11.91,0.91 12.05,0.85 12.19,0.91 12.64,1.36 12.7,1.5 12.64,1.64 12.5,1.7 12.36,1.64
  cutout layer 2: 11.91,1.19 11.85,1.05 11.91,0.91 12.05,0.85 12.19,0.91 12.64,1.36 12.7,1.5 12.64,1.64 12.5,1.7 12.36,1.64
  cutout Top: 11.91,1.19 11.85,1.05 11.91,0.91 12.05,0.85 12.19,0.91 12.64,1.36 12.7,1.5 12.64,1.64 12.5,1.7 12.36,1.64
+3_3V
  Top 0.3: R3.2 21.67,5.44
  Top 0.8: C6.2 C9.2 C7.2 C8.2 21.67,5.44 21.19,5.44 L1.2
  Top 1: C6.2 30.42,3.6 K3.3
+5V
  Top 0.6: R5.2 15.09,5.12 IC2.5
  Top 0.8: K1.1 12.47,9.24 12.47,6.58 R5.2
  Top 1: 22.16,11.97 C2.2 C1.2 C4.2 C3.2 12.28,11.97 K1.1
  Top 1.2: IC1.1 22.16,11.97 22.16,10.02 D1.2
  Bottom 1: 22.56,13.15 IC1.1
D+
  Bottom 0.3: K1.3 15.23,1.98 19.09,1.98 20.6,0.46 23.8,0.46 24.92,1.59 26.71,1.59 K3.4
D-
  Bottom 0.3: K1.2 12.21,7 12.21,5.75 15.44,2.52 19.3,2.52 20.83,0.98 23.57,0.98 K3.5
GND  (via drill 0.4 pad 1)
  Top 0.4: C7.1 26.84,7.27 | C7.1 26.09,7.97 | C7.1 25.34,7.27 | C7.1 26.09,6.57 | C8.1 25.54,7.27 | C8.1 24.79,7.97 | C8.1 24.04,7.27 | C8.1 24.79,6.57 | C9.1 28.12,7.27 | C9.1 27.37,7.97 | C9.1 26.62,7.27 | C9.1 27.37,6.57 | C6.1 29.34,7.28 | C6.1 28.59,7.98 | C6.1 27.84,7.28 | C6.1 28.59,6.58
  Top 0.5: 14.86,9.83 14.81,9.83 C3.1 | 13.82,10.76 13.82,10.71 C3.1 | 13.82,8.9 13.82,8.95 C3.1 | 16.96,9.83 16.92,9.83 C4.1 | 15.93,10.76 15.93,10.71 C4.1 | 14.89,9.83 14.94,9.83 C4.1 | 15.93,8.9 15.93,8.95 C4.1 | 19.06,9.83 19.01,9.83 C1.1 | 18.02,10.76 18.02,10.71 C1.1 | 16.98,9.83 17.03,9.83 C1.1 | 18.02,8.9 18.02,8.95 C1.1 | 20.15,10.76 20.15,10.71 C2.1 | 19.11,9.83 19.16,9.83 C2.1 | 20.15,8.9 20.15,8.95 C2.1 | 16.72,6.04 IC2.2 18.32,6.04 18.39,6.04 | R4.1 18.71,5.86
  Top 0.6: 12.21,3.7 12.11,3.7 K1.4 | 11.01,4.9 11.01,4.8 K1.4 | 9.81,3.7 9.91,3.7 K1.4 | 11.01,2.5 11.01,2.6 K1.4 | 14.96,3.25 14.91,3.25 D2.2 | 14.01,4.35 14.01,4.3 D2.2 | 13.06,3.25 13.11,3.25 D2.2 | 14.01,2.15 14.01,2.2 D2.2 | 36.7,2.75 36.6,2.75 K3.1 | 35.5,3.95 35.5,3.85 K3.1 | 34.3,2.75 34.4,2.75 K3.1 | 35.5,1.55 35.5,1.65 K3.1 | 34.16,2.75 34.06,2.75 K3.2 | 32.96,3.95 32.96,3.85 K3.2 | 31.76,2.75 31.86,2.75 K3.2 | 32.96,1.55 32.96,1.65 K3.2
  Top 0.8: 28.69,13.15 28.54,13.15 IC1.3 | 25.79,13.15 25.94,13.15 IC1.3 | 27.24,11.7 27.24,11.85 IC1.3 | 29.42,9.83 29.25,9.83 D1.1 | 27.85,11.41 27.85,11.23 D1.1 | 26.27,9.83 26.45,9.83 D1.1 | 27.85,8.26 27.85,8.43 D1.1
  Bottom 0.2: 31.31,7.48 32.29,7.48 | v34.71,4.96 35.98,4.96
  Bottom 0.4: 36.7,2.75 36.6,2.75 K3.1 | 35.5,3.95 35.5,3.85 K3.1 | 34.3,2.75 34.4,2.75 K3.1 | 35.5,1.55 35.5,1.65 K3.1 | 34.16,2.75 34.06,2.75 K3.2 | 32.96,3.95 32.96,3.85 K3.2 | 31.76,2.75 31.86,2.75 K3.2 | 32.96,1.55 32.96,1.65 K3.2
  Bottom 0.6: 12.31,3.7 12.11,3.7 K1.4 | 11.01,5 11.01,4.8 K1.4 | 9.71,3.7 9.91,3.7 K1.4 | 11.01,2.4 11.01,2.6 K1.4
  Bottom 0.8: 28.84,13.15 28.54,13.15 IC1.3 | 25.64,13.15 25.94,13.15 IC1.3 | 27.24,11.55 27.24,11.85 IC1.3
  other vias: 37.03,1.51 34.23,1.12 31.65,1.09 29.13,1.14 23.87,3.99 23.08,1.95 21.35,1.95 26.55,4.29 15.96,3.7 16.23,6.03 17.58,8.28 14.7,8.27 20.6,8.19 25.17,8.96 12.29,2.6 9.79,2.13 8.75,4.14 8.73,7.4 8.81,10.97 24.69,13.39 24.91,11.36 23.44,7.93 23.47,6.72 25.29,0.72
  pour Bottom (isolate 0.2): 86.4,14.3 0.1,14.3 0.1,0.1 86.4,0.1 86.4,14.3
  pour Top (isolate 0.2): 86.4,14.3 0.1,14.3 0.1,0.1 86.4,0.1 86.4,14.3
SIG$3
  Top 1: R2.1 71.22,11.17 F1.2
SIG$4
  Top 1: IC1.12 62.8,13.15 R1.2 69.8,6.16 R2.2
SIG$5
  Bottom 1: K2.2 79.87,2.26 66.54,2.26 65.5,3.29 R1.1 60.32,5.37
  Bottom 1.5: C5.2 60.32,5.37 59.53,4.58 45.99,4.58 37.4,13.17 IC1.7
SIG$6
  Top 1: F1.1 79.57,11.01 K2.1
SIG$7
  Top 0.3: IC2.3 R4.2 19.63,6.98 R3.1 19.82,6.97
SIG$8
  Top 1.5: C5.1 53.9,7.8 46.79,7.8 45.02,9.57 IC1.10
SIG$9
  Top 0.3: IC2.4 13.97,6.99 R5.1
SIG$14  (via drill 0.4 pad 1)
  other vias: 30.54,8.22
SIG$15  (via drill 0.4 pad 1)
  other vias: 32.37,6.37
SW
  Top 0.8: IC2.1 D2.1 L1.1

### Text on the board
Top: TOP
Bottom: BOT